# Altium project Leak and Level Sense.PrjPcb
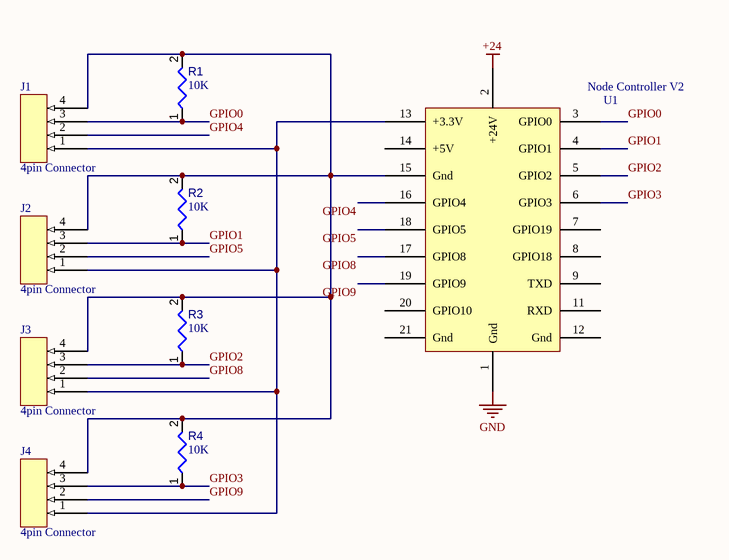
[diagram p0: Leak and Level Sense.SchDoc]
1 sheet, 9 parts. Net scope: global (net labels, ports and power ports of the same name join across sheets).

## Sheet Leak and Level Sense.SchDoc
size A

### Parts
J1  4pin Connector
J2  4pin Connector
J3  4pin Connector
J4  4pin Connector
R1  value 10K  [RESC0402(1005)_L]  (hidden comment: Resistor 2K2  +/-5 % 0402 63 mW)
R2  value 10K  [RESC0402(1005)_L]  (hidden comment: Resistor 2K2  +/-5 % 0402 63 mW)
R3  value 10K  [RESC0402(1005)_L]  (hidden comment: Resistor 2K2  +/-5 % 0402 63 mW)
R4  value 10K  [RESC0402(1005)_L]  (hidden comment: Resistor 2K2  +/-5 % 0402 63 mW)
U1  Node Controller V2

### Nets
+24: U1.2(+24V)
GND: U1.1(Gnd)
GPIO0: J1.3 R1.1 U1.3(GPIO0)
GPIO1: J2.3 R2.1 U1.4(GPIO1)
GPIO2: J3.3 R3.1 U1.5(GPIO2)
GPIO3: J4.3 R4.1 U1.6(GPIO3)
GPIO4: J1.2 U1.16(GPIO4)
GPIO5: J2.2 U1.18(GPIO5)
GPIO8: J3.2 U1.17(GPIO8)
GPIO9: J4.2 U1.19(GPIO9)
NetJ1_1: J1.1 J2.1 J3.1 J4.1 U1.13(+3.3V)
NetJ1_4: J1.4 J2.4 J3.4 J4.4 R1.2 R2.2 R3.2 R4.2 U1.15(Gnd)

Not connected (* = marked no-connect by the designer): U1 7(GPIO19) 8(GPIO18) 9(TXD) 11(RXD) 12(Gnd) 14(+5V) 20(GPIO10) 21(Gnd)

### Library data of the parts
R1-R4 = RES-2: Chip Resistor, 2,2 kOhms, +/-5 %, 63 mW, -55 to 155 degC, 0402; Power: 63mW; Tolerance: 5%; Pins: 2; Min Operating Temperature: -55°C; Max Operating Temperature: 155°C; Case/Package: 0402